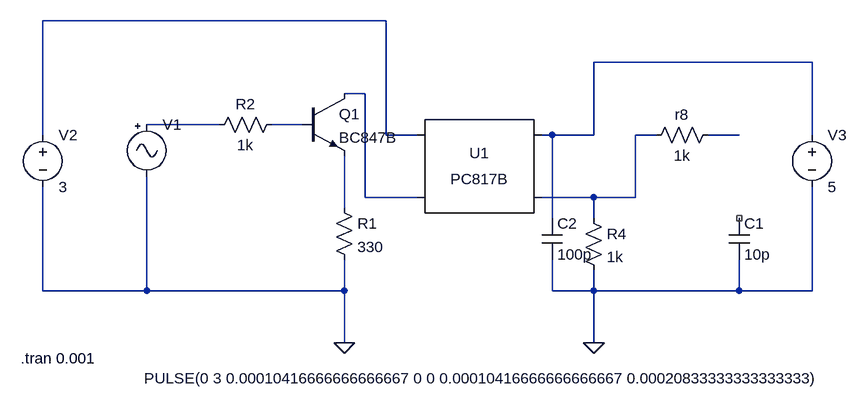
[diagram p0: schematic CurrentNonInverting.asc]
CurrentNonInverting.asc, the LTspice schematic file:
Version 4
SHEET 1 1000 680
WIRE 48 -240 -480 -240
WIRE 704 -176 368 -176
WIRE 16 -128 -16 -128
WIRE -208 -80 -320 -80
WIRE -80 -80 -128 -80
WIRE -480 -64 -480 -240
WIRE 48 -64 48 -240
WIRE 96 -64 48 -64
WIRE 304 -64 288 -64
WIRE 368 -64 368 -176
WIRE 368 -64 304 -64
WIRE 464 -64 432 -64
WIRE 592 -64 544 -64
WIRE 704 -64 704 -176
WIRE 16 32 16 -128
WIRE 96 32 16 32
WIRE 368 32 288 32
WIRE 432 32 432 -64
WIRE 432 32 368 32
WIRE -16 48 -16 -32
WIRE 304 64 304 -64
WIRE 368 64 368 32
WIRE -480 176 -480 16
WIRE -320 176 -320 0
WIRE -320 176 -480 176
WIRE -16 176 -16 128
WIRE -16 176 -320 176
WIRE 304 176 304 128
WIRE 368 176 368 144
WIRE 368 176 304 176
WIRE 592 176 592 128
WIRE 592 176 368 176
WIRE 704 176 704 16
WIRE 704 176 592 176
WIRE -16 256 -16 176
WIRE 368 256 368 176
FLAG -16 256 0
FLAG 368 256 0
SYMBOL res -32 32 R0
SYMATTR InstName R1
SYMATTR Value 330
SYMBOL res -112 -96 R90
WINDOW 0 0 56 VBottom 2
WINDOW 3 32 56 VTop 2
SYMATTR InstName R2
SYMATTR Value 1k
SYMBOL res 560 -80 R90
WINDOW 0 0 56 VBottom 2
WINDOW 3 32 56 VTop 2
SYMATTR InstName r8
SYMATTR Value 1k
SYMBOL res 352 48 R0
SYMATTR InstName R4
SYMATTR Value 1k
SYMBOL Optos\\PC817B 192 -16 R0
SYMATTR InstName U1
SYMBOL npn -80 -128 R0
SYMATTR InstName Q1
SYMATTR Value BC847B
SYMBOL Misc\\signal -320 -96 R0
WINDOW 3 -4 407 Left 2
WINDOW 123 0 0 Left 2
WINDOW 39 0 0 Left 2
SYMATTR InstName V1
SYMATTR Value PULSE(0 3 0.00010416666666666667 0 0 0.00010416666666666667 0.00020833333333333333)
SYMBOL voltage -480 -80 R0
WINDOW 123 0 0 Left 2
WINDOW 39 0 0 Left 2
SYMATTR InstName V2
SYMATTR Value 3
SYMBOL voltage 704 -80 R0
WINDOW 123 0 0 Left 2
WINDOW 39 0 0 Left 2
SYMATTR InstName V3
SYMATTR Value 5
SYMBOL cap 576 64 R0
SYMATTR InstName C1
SYMATTR Value 10p
SYMBOL cap 288 64 R0
SYMATTR InstName C2
SYMATTR Value 100p
TEXT -514 280 Left 2 !.tran 0.001

The netlist it stands for:
* CurrentNonInverting.asc
R1 N008 0 330
R2 N005 N004 1k
r8 N007 N006 1k
R4 N006 0 1k
XU1 N001 N003 N002 N006 PC817 Igain=1.5m
Q1 N003 N005 N008 0 BC847B
V1 N004 0 PULSE(0 3 0.00010416666666666667 0 0 0.00010416666666666667 0.00020833333333333333)
V2 N001 0 3
V3 N002 0 5
C1 NC_01 0 10p
C2 N002 0 100p
.model NPN NPN
.model PNP PNP
.lib standard.bjt
.tran 0.001
.lib PC817.sub
.backanno
.end